# EasyEDA Pro project 新星杯51电子琴最终版.eprj

# Schematic Schematic1
Board Name: Board1; Create Date: 2025-08-16; Page Name: P1; Project Name: 新星杯51电子琴最终版; Schematic Name: Schematic1; Update Date: 2025-08-16; Company: 嘉立创EDA; Page Size: A4; Version: V1.0
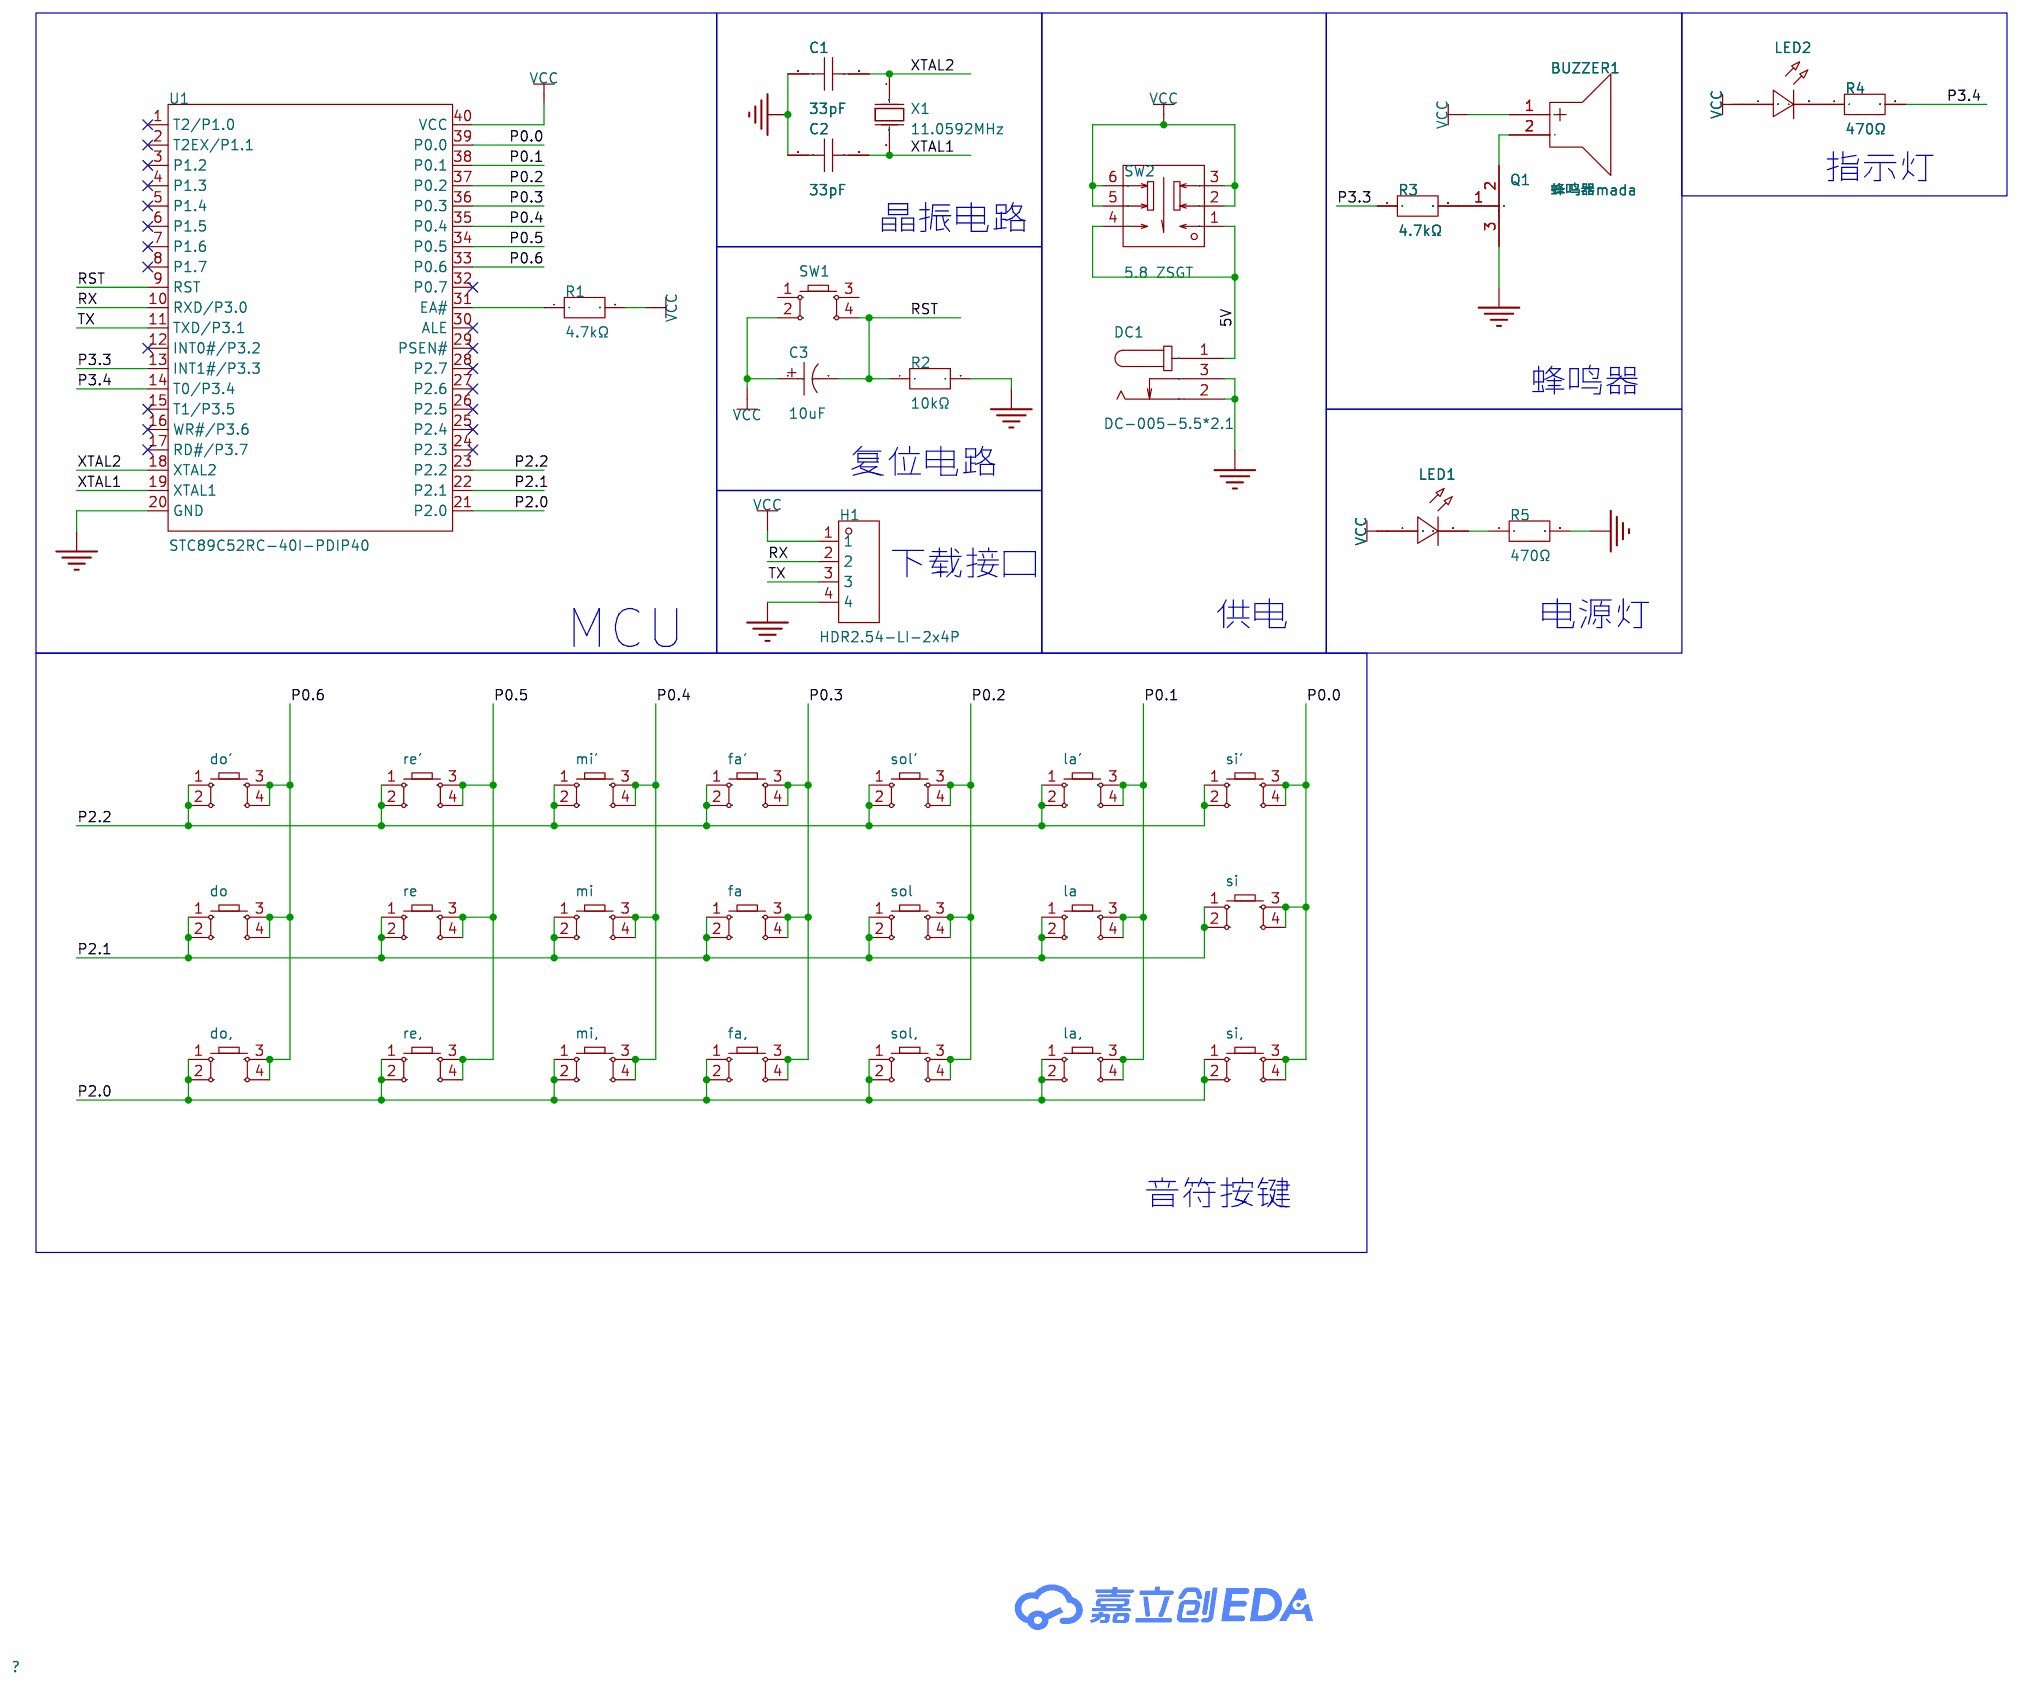
[diagram p0: schematic sheet]

## Parts
BUZZER1  蜂鸣器mada  [BUZ-TH_BD9.2-P5.00-D0.6-L-FD]
C1  33pF  [CAP-TH_L5.5-W5.0-P5.00-D0.6]
C2  33pF  [CAP-TH_L5.5-W5.0-P5.00-D0.6]
C3  10uF  [CAP-TH_BD5.0-P2.00-D0.5-FD]
DC1  DC-005-5.5*2.1  [DC-IN-TH_DC-005-2]
do  -  [SW-TH_4P-L6.0-W6.0-P4.50-LS6.5]
do'  -  [SW-TH_4P-L6.0-W6.0-P4.50-LS6.5]
do,  -  [SW-TH_4P-L6.0-W6.0-P4.50-LS6.5]
fa  -  [SW-TH_4P-L6.0-W6.0-P4.50-LS6.5]
fa'  -  [SW-TH_4P-L6.0-W6.0-P4.50-LS6.5]
fa,  -  [SW-TH_4P-L6.0-W6.0-P4.50-LS6.5]
H1  HDR2.54-LI-2x4P  [HDR-TH_4P-P2.54-V-M]
la  -  [SW-TH_4P-L6.0-W6.0-P4.50-LS6.5]
la'  -  [SW-TH_4P-L6.0-W6.0-P4.50-LS6.5]
la,  -  [SW-TH_4P-L6.0-W6.0-P4.50-LS6.5]
LED1  -  [LED_TH-3mm]
LED2  -  [LED-TH_5mm]
mi  -  [SW-TH_4P-L6.0-W6.0-P4.50-LS6.5]
mi'  -  [SW-TH_4P-L6.0-W6.0-P4.50-LS6.5]
mi,  -  [SW-TH_4P-L6.0-W6.0-P4.50-LS6.5]
Q1  -  [宽三极管]
R1  4.7kΩ  [RES-TH_BD2.2-L6.5-P10.50-D0.6]
R2  10kΩ  [RES-TH_BD2.2-L6.5-P10.50-D0.6]
R3  4.7kΩ  [RES-TH_BD2.2-L6.5-P10.50-D0.6]
R4  470Ω  [RES-TH_BD2.2-L6.5-P10.50-D0.6]
R5  470Ω  [RES-TH_BD2.2-L6.5-P10.50-D0.6]
re  -  [SW-TH_4P-L6.0-W6.0-P4.50-LS6.5]
re'  -  [SW-TH_4P-L6.0-W6.0-P4.50-LS6.5]
re,  -  [SW-TH_4P-L6.0-W6.0-P4.50-LS6.5]
si  -  [SW-TH_4P-L6.0-W6.0-P4.50-LS6.5]
si'  -  [SW-TH_4P-L6.0-W6.0-P4.50-LS6.5]
si,  -  [SW-TH_4P-L6.0-W6.0-P4.50-LS6.5]
sol  -  [SW-TH_4P-L6.0-W6.0-P4.50-LS6.5]
sol'  -  [SW-TH_4P-L6.0-W6.0-P4.50-LS6.5]
sol,  -  [SW-TH_4P-L6.0-W6.0-P4.50-LS6.5]
SW1  -  [SW-TH_4P-L6.0-W6.0-P4.50-LS6.5]
SW2  5.8 ZSGT  [SW-TH_5.8ZSGT]
U1  STC89C52RC-40I-PDIP40  [DIP-40_L52.0-W13.7-P2.54-LS15.2-BL]
X1  11.0592MHz  [HC-49US_L11.5-W4.5-P4.88]

## Library data of the parts
BUZZER1 = 蜂鸣器mada: Supplier Part: C9900017272; Supplier Footprint: BUZ-TH; JLCPCB Part Class: 扩展库; Supplier: LCSC
C1 C2 = CC45SL3DD330JYGNA: 容值:33pF;精度:±5%;额定电压:2kV;温度系数:SL;; LCSC Part Name: 33pF ±5% 2kV; Supplier Part: C5567764; Manufacturer: TDK; Supplier Footprint: 插件; JLCPCB Part Class: 扩展库; Datasheet: https://atta.szlcsc.com/upload/public/pdf/source/20221215/8A5EDD14E2FEF475EBFA37253E4ED503.pdf; Supplier: LCSC; Tolerance: ±5%; Voltage Rating: 2kV; Pin Spacing: 5mm; Temperature Coefficient: SL; Diameter: 5.5mm
C3 = KM106M025D11RR0VH2FP0: 容值:10uF;精度:±20%;额定电压:25V;纹波电流:38mA@120Hz;等效串联电阻(ESR):-;; LCSC Part Name: 10uF ±20% 25V; Supplier Part: C43347; Manufacturer: CX(承兴); Supplier Footprint: 插件,D5xL11mm; JLCPCB Part Class: 扩展库; Datasheet: https://atta.szlcsc.com/upload/public/pdf/source/20211027/06D6BA3719C264B639DC286D935D03EA.pdf; Supplier: LCSC; Tolerance: ±20%; Voltage Rating: 25V; Ripple Current: 38mA@120Hz; Pin Spacing: 2mm; Diameter: 5mm; Height - Seated (Max): 11mm; Lifetime: 1000hrs@105℃
DC1 = DC-005-5.5*2.1: Supplier Part: C9900017044; Supplier Footprint: DC-005; JLCPCB Part Class: 扩展库; Supplier: LCSC
do do' do, fa fa' fa, la la' la, mi mi' mi, re re' re, si si' si, sol sol' sol, SW1 = Key_TH_6x6x6: 触点电流:50mA;额定电压(DC):12V;绝缘电阻:100MΩ;电路结构:单刀单掷;安装方式:直插;按钮形状:圆形按钮;按钮/盖帽颜色:黑色;作用力:260gf@±30gf;工作温度:-25℃~+70℃;引脚样式:PC引脚;开关长度:6mm;开关宽度:6mm;开关高度:6mm;带支架:否;; Supplier Part: C2837516; Supplier Footprint: 插件
H1 = HDR2.54-LI-2x4P: Supplier Part: C9900020145; JLCPCB Part Class: 扩展库; Supplier: LCSC
LED1 = LED_TH-R_3mm: Supplier Footprint: 插件
LED2 = LED_TH-R_5mm: Supplier Footprint: 插件
Q1 = 宽三极管
R1-R3 = MF0W4FF4701A50: 电阻类型:金属膜电阻;阻值:4.7kΩ;精度:±1%;功率:250mW;温度系数:±50ppm/℃;; Supplier Part: C20625253; Manufacturer: UNI-ROYAL(厚声); Supplier Footprint: DIP; JLCPCB Part Class: 扩展库; Datasheet: https://atta.szlcsc.com/upload/public/pdf/source/20240311/FBFC508D1107E2DDB63DCA17D99F8DB3.pdf; Supplier: LCSC; Type: 金属膜电阻; Tolerance: ±1%; Power(Watts): 250mW; Temperature Coefficient: ±50ppm/℃
R4 R5 = MF0W4FF4700A50: 电阻类型:金属膜电阻;阻值:470Ω;精度:±1%;功率:250mW;温度系数:±50ppm/℃;; Supplier Part: C20625244; Manufacturer: UNI-ROYAL(厚声); Supplier Footprint: DIP; JLCPCB Part Class: 扩展库; Datasheet: https://atta.szlcsc.com/upload/public/pdf/source/20240311/FBFC508D1107E2DDB63DCA17D99F8DB3.pdf; Supplier: LCSC; Type: 金属膜电阻; Tolerance: ±1%; Power(Watts): 250mW; Temperature Coefficient: ±50ppm/℃
SW2 = 5.8 ZSGT: 电路结构:双刀双掷;自锁/无锁:自锁;安装方式:直插;触点电流:110mA;额定电压 (DC):30V;带灯:不带;作用力:1.5N;机械寿命:10万次;; LCSC Part Name: 5.8*5.8有头/高头 带锁/自锁开关 泡泡机开关; Supplier Part: C2681587; Manufacturer: SHOU HAN(首韩); Supplier Footprint: 插件; JLCPCB Part Class: 扩展库; Datasheet: https://atta.szlcsc.com/upload/public/pdf/source/20210107/C2681587_CDDDDA4A1C7AC9FEB01815B75893A6BA.pdf; Supplier: LCSC; Circuit: 双刀双掷; Self Lock / No Lock: 自锁; Actuator Style: 方形按钮; Mounting Style: 直插; Contact Current: 110mA; Voltage Rating (DC): 30V; Insulation Resistance: 100MΩ; Actuator/Cap Color: 白色; With Lamp: 不带; Pin Style: PC引脚; Operating Force: 1.5N; Operating Temperature: -10℃~+70℃; Mechanical Life: 10万次
U1 = STC89C52RC-40I-PDIP40: CPU内核:51系列;应用领域:-;; Supplier Part: C14022; Manufacturer: STC; Supplier Footprint: DIP-40; JLCPCB Part Class: 扩展库; Datasheet: https://atta.szlcsc.com/upload/public/pdf/source/20250219/C2F0DDDE7C5E9ADA5B33742D18630F09.pdf; Supplier: LCSC; CPU Core: 51系列; Program Storage Size: 8KB; Program Memory Type: FLASH; Number of I/O: 35; Voltage - Supply: 3.3V~5.5V
X1 = X49SD110592MSD2SC: 晶振类型:直插晶振;频率:11.0592MHz;常温频差:±20ppm;负载电容:20pF;频率稳定度:±30ppm;; LCSC Part Name: HC-49US 11.0592MHZ 2P 49S 20PF ±20PPM -20~70℃（±30PPM）; Supplier Part: C2203; Manufacturer: YXC(扬兴晶振); Supplier Footprint: HC-49S; JLCPCB Part Class: 扩展库; Datasheet: https://atta.szlcsc.com/upload/public/pdf/source/20240329/977D7F2434F98B2BE33270BB9FF3D86D.pdf; Supplier: LCSC; Type: 直插晶振; Normal temperature Frequency Tolerance: ±20ppm; Load Capacitance: 20pF; Frequency Stability: ±30ppm; Operating Temperature: -20℃~+70℃

## Nets
5V: DC1.1 SW2.1 SW2.4
GND: C1.1 C2.1 DC1.2 DC1.3 H1.4 Q1.3 R2.2 R5.2 U1.20(GND)
VCC: BUZZER1.1(+) C3.1 H1.1 LED1.1(C) LED2.1(C) R1.2 SW1.2 SW2.2 SW2.3 SW2.5 SW2.6 U1.40(VCC)
P0.0: si.3 si.4 si'.3 si'.4 si,.3 si,.4 U1.39(P0.0)
P0.1: la.3 la.4 la'.3 la'.4 la,.3 la,.4 U1.38(P0.1)
P0.2: sol.3 sol.4 sol'.3 sol'.4 sol,.3 sol,.4 U1.37(P0.2)
P0.3: fa.3 fa.4 fa'.3 fa'.4 fa,.3 fa,.4 U1.36(P0.3)
P0.4: mi.3 mi.4 mi'.3 mi'.4 mi,.3 mi,.4 U1.35(P0.4)
P0.5: re.3 re.4 re'.3 re'.4 re,.3 re,.4 U1.34(P0.5)
P0.6: do.3 do.4 do'.3 do'.4 do,.3 do,.4 U1.33(P0.6)
P2.0: do,.1 do,.2 fa,.1 fa,.2 la,.1 la,.2 mi,.1 mi,.2 re,.1 re,.2 si,.1 si,.2 sol,.1 sol,.2 U1.21(P2.0)
P2.1: do.1 do.2 fa.1 fa.2 la.1 la.2 mi.1 mi.2 re.1 re.2 si.1 si.2 sol.1 sol.2 U1.22(P2.1)
P2.2: do'.1 do'.2 fa'.1 fa'.2 la'.1 la'.2 mi'.1 mi'.2 re'.1 re'.2 si'.1 si'.2 sol'.1 sol'.2 U1.23(P2.2)
P3.3: R3.1 U1.13(INT1#/P3.3)
P3.4: R4.2 U1.14(T0/P3.4)
RST: C3.2 R2.1 SW1.4 U1.9(RST)
RX: H1.2 U1.10(RXD/P3.0)
TX: H1.3 U1.11(TXD/P3.1)
XTAL1: C2.2 U1.19(XTAL1) X1.2(OSC2)
XTAL2: C1.2 U1.18(XTAL2) X1.1(OSC1)
Net-(BUZZER1-2): BUZZER1.2(-) Q1.2
Net-(LED1-2): LED1.2(A) R5.1
Net-(LED2-2): LED2.2(A) R4.1
Net-(Q1-1): Q1.1 R3.2
Net-(R1-1): R1.1 U1.31(EA#)

Not connected (* = marked no-connect by the designer): SW1 1 3; U1 1(T2/P1.0)* 2(T2EX/P1.1)* 3(P1.2)* 4(P1.3)* 5(P1.4)* 6(P1.5)* 7(P1.6)* 8(P1.7)* 12(INT0#/P3.2)* 15(T1/P3.5)* 16(WR#/P3.6)* 17(RD#/P3.7)* 24(P2.3)* 25(P2.4)* 26(P2.5)* 27(P2.6)* 28(P2.7)* 29(PSEN#)* 30(ALE)* 32(P0.7)*

## Notes on the sheet
- 指示灯
- 晶振电路
- 蜂鸣器
- 复位电路
- 下载接口
- 供电
- 电源灯
- MCU
- 音符按键

# Board PCB1
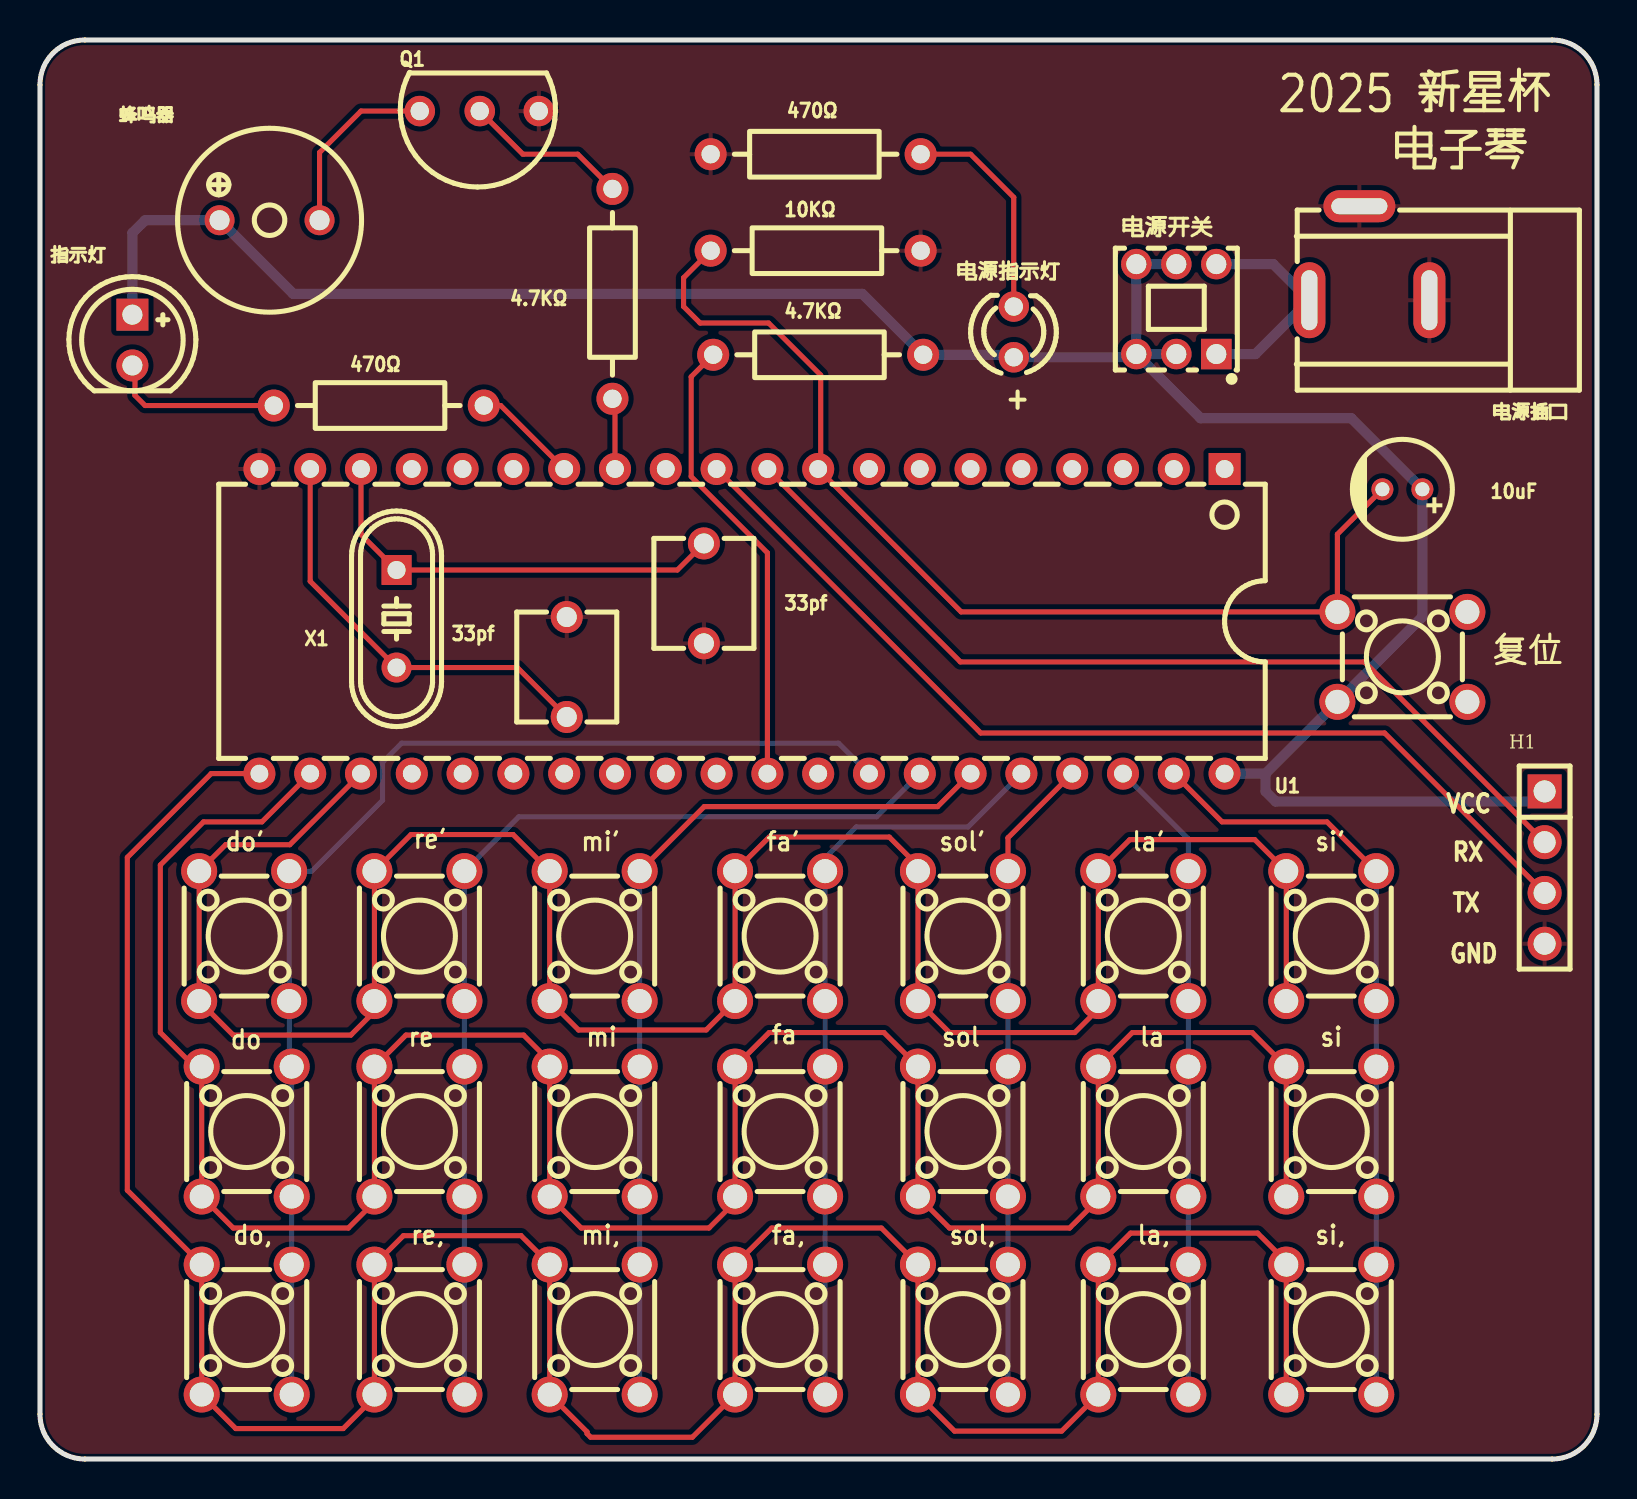
[diagram p1: board, top side]
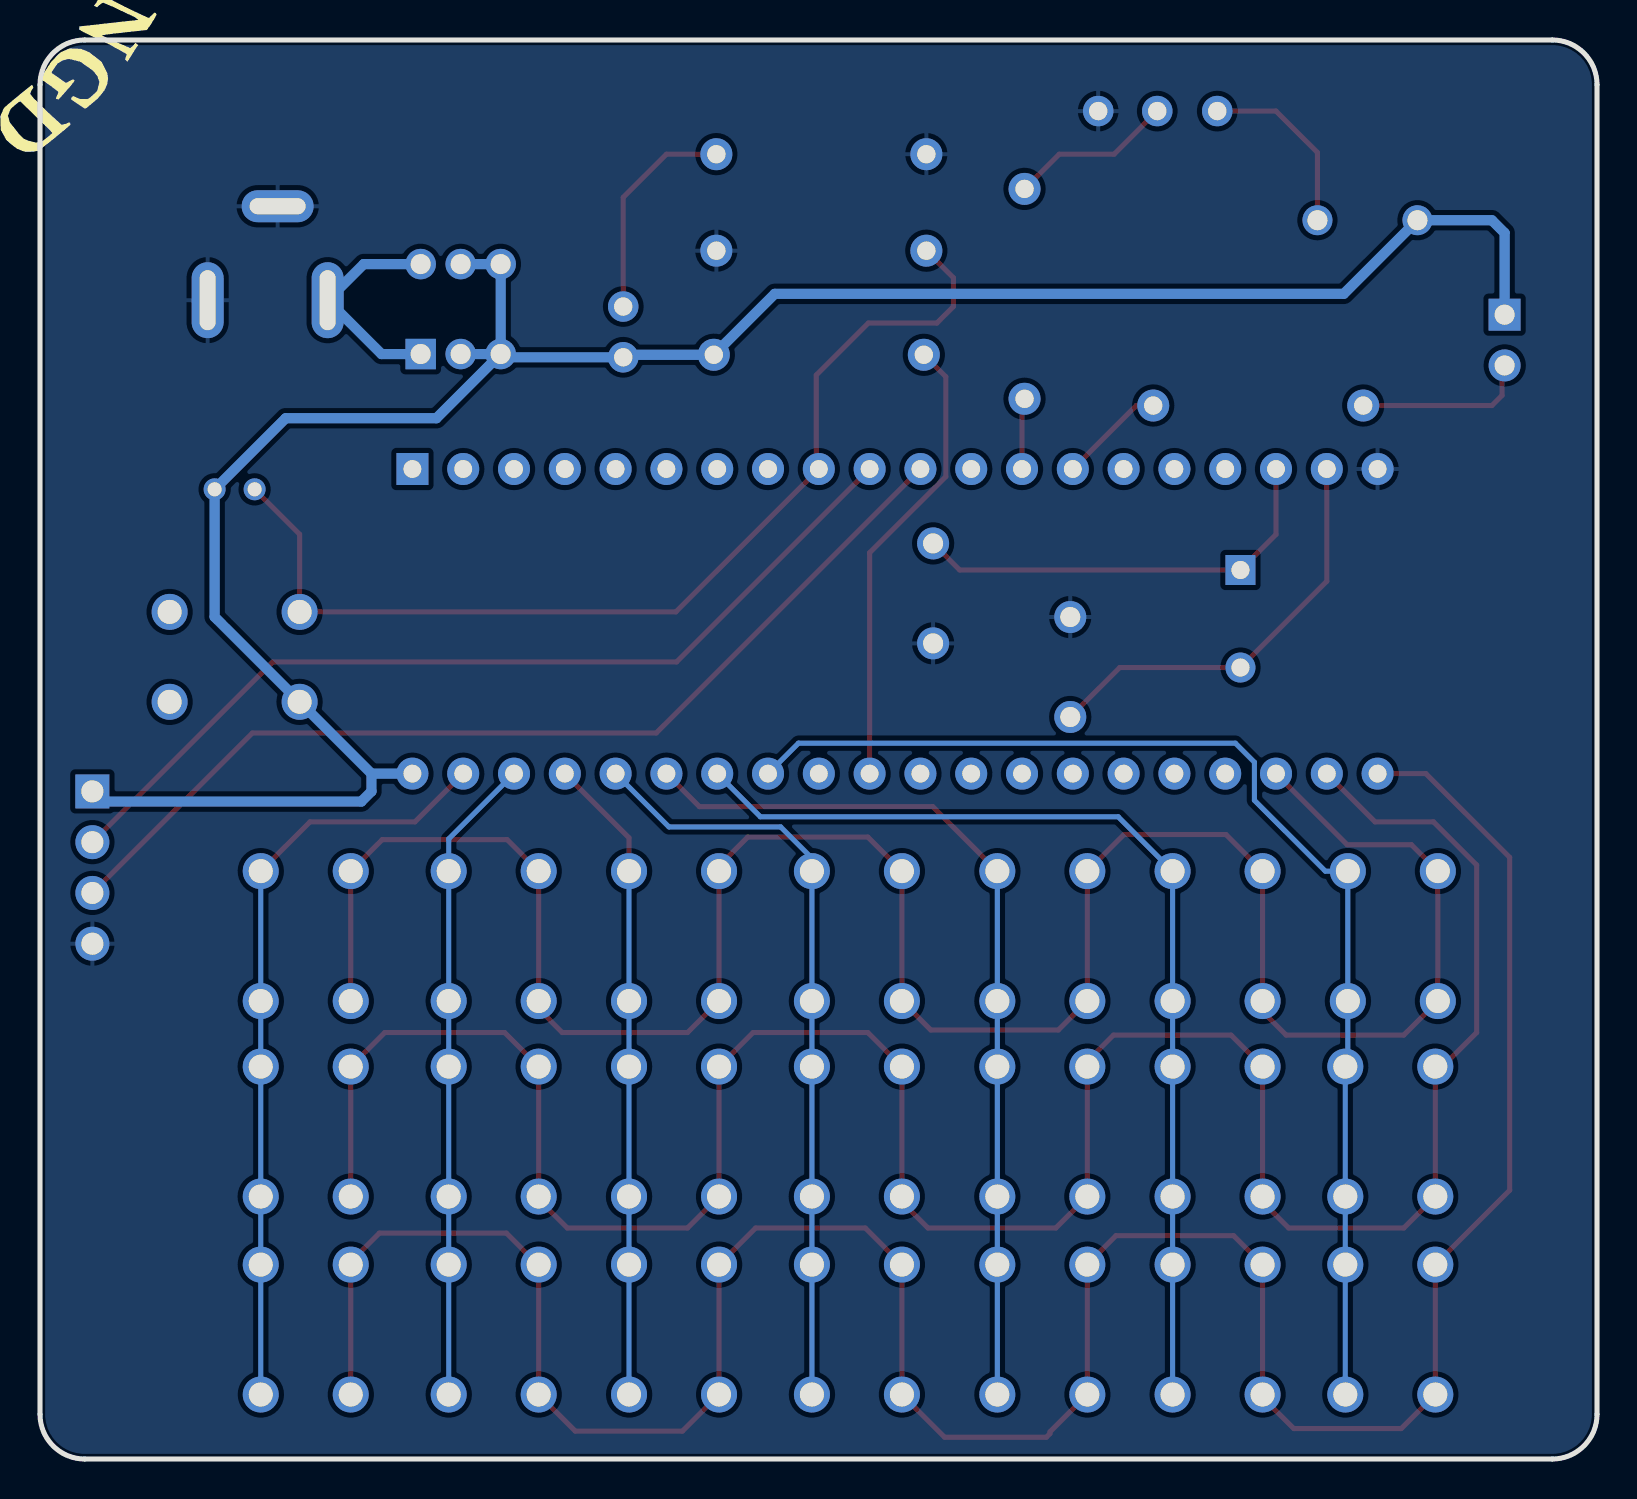
[diagram p2: board, bottom side, seen from below]

Outline 77.85 x 70.99 mm; copper layers: Top Layer, Bottom Layer. Coordinates in mm from the lower left corner of the outline.
Outline path: 0,68.76 0,2.23 arc(0.66,0.65) 2.24,0 75.62,0 arc(77.2,0.65) 77.85,2.23 77.85,68.76 arc(77.2,70.34) 75.62,70.99 2.24,70.99 arc(0.65,70.34) 0,68.76
Stack: Top Layer 0.035mm / Dielectric1 1.51mm FR4 er 4.5 / Bottom Layer 0.035mm

## Design rules (mm)
template: JLCPCB Capability(Two Layers Board)
spacing copperThickness1oz (default): track to track 0.102, other pairs 0.152 to 0.3
spacing copperThickness2oz: track to track 0.203, other pairs 0.152 to 0.3
track width copperThickness1oz (default): min 0.127, default 0.254, max 2.54
track width copperThickness2oz: min 0.203, default 0.254, max 2.54
differential pair differentialPair (default): width min 0.127, default 0.254, max 2.54; gap min 0.152, default 0.152
via viaSize (default): diameter min 0.5, default 0.61, max 10; hole min 0.3, default 0.305, max 6.3

## Placement (name value [footprint] x y rotation side)
4.7KΩ  -  [RES-TH_BD2.2-L6.5-P10.50-D0.6]  38.91 55.24 0 top
4.7KΩ#2  -  [RES-TH_BD2.2-L6.5-P10.50-D0.6]  28.62 58.29 90 top
10KΩ  10kΩ  [RES-TH_BD2.2-L6.5-P10.50-D0.6]  38.78 60.45 0 top
10uF  10uF  [CAP-TH_BD5.0-P2.00-D0.5-FD]  68.12 48.51 180 top
33pf  -  [CAP-TH_L5.5-W5.0-P5.00-D0.6]  33.2 43.31 90 top
33pf#2  -  [CAP-TH_L5.5-W5.0-P5.00-D0.6]  26.34 39.62 270 top
470Ω  -  [RES-TH_BD2.2-L6.5-P10.50-D0.6]  16.94 52.7 0 top
470Ω#2  -  [RES-TH_BD2.2-L6.5-P10.50-D0.6]  38.78 65.28 180 top
do  -  [SW-TH_4P-L6.0-W6.0-P4.50-LS6.5]  10.34 16.38 90 top
do'  -  [SW-TH_4P-L6.0-W6.0-P4.50-LS6.5]  10.21 26.16 90 top
do,  -  [SW-TH_4P-L6.0-W6.0-P4.50-LS6.5]  10.34 6.48 90 top
fa  -  [SW-TH_4P-L6.0-W6.0-P4.50-LS6.5]  37.01 16.38 90 top
fa'  -  [SW-TH_4P-L6.0-W6.0-P4.50-LS6.5]  37.01 26.16 90 top
fa,  -  [SW-TH_4P-L6.0-W6.0-P4.50-LS6.5]  37.01 6.48 90 top
H1  HDR2.54-LI-2x4P  [HDR-TH_4P-P2.54-V-M]  75.23 29.59 270 top
la  -  [SW-TH_4P-L6.0-W6.0-P4.50-LS6.5]  55.17 16.38 90 top
la'  -  [SW-TH_4P-L6.0-W6.0-P4.50-LS6.5]  55.17 26.16 90 top
la,  -  [SW-TH_4P-L6.0-W6.0-P4.50-LS6.5]  55.17 6.48 90 top
mi  -  [SW-TH_4P-L6.0-W6.0-P4.50-LS6.5]  27.73 16.38 90 top
mi'  -  [SW-TH_4P-L6.0-W6.0-P4.50-LS6.5]  27.73 26.16 90 top
mi,  -  [SW-TH_4P-L6.0-W6.0-P4.50-LS6.5]  27.73 6.48 90 top
Q1  -  [宽三极管]  22.02 67.18 0 top
re  -  [SW-TH_4P-L6.0-W6.0-P4.50-LS6.5]  18.97 16.38 90 top
re'  -  [SW-TH_4P-L6.0-W6.0-P4.50-LS6.5]  18.97 26.16 90 top
re,  -  [SW-TH_4P-L6.0-W6.0-P4.50-LS6.5]  18.97 6.48 90 top
si  -  [SW-TH_4P-L6.0-W6.0-P4.50-LS6.5]  64.56 16.38 90 top
si'  -  [SW-TH_4P-L6.0-W6.0-P4.50-LS6.5]  64.56 26.16 90 top
si,  -  [SW-TH_4P-L6.0-W6.0-P4.50-LS6.5]  64.56 6.48 90 top
sol  -  [SW-TH_4P-L6.0-W6.0-P4.50-LS6.5]  46.15 16.38 90 top
sol'  -  [SW-TH_4P-L6.0-W6.0-P4.50-LS6.5]  46.15 26.16 90 top
sol,  -  [SW-TH_4P-L6.0-W6.0-P4.50-LS6.5]  46.15 6.48 90 top
U1  STC89C52RC-40I-PDIP40  [DIP-40_L52.0-W13.7-P2.54-LS15.2-BL]  35.1 41.91 180 top
X1  11.0592MHz  [HC-49US_L11.5-W4.5-P4.88]  17.83 42.04 270 top
复位  -  [SW-TH_4P-L6.0-W6.0-P4.50-LS6.5]  68.12 40.13 180 top
指示灯  -  [LED-TH_5mm]  4.62 55.98 270 top
电源开关  5.8 ZSGT  [SW-TH_5.8ZSGT]  56.82 57.53 0 top
电源指示灯  -  [LED_TH-3mm]  48.69 56.39 90 top
电源插口  DC-005-5.5*2.1  [DC-IN-TH_DC-005-2]  66.47 60.32 180 top
蜂鸣器  蜂鸣器mada  [BUZ-TH_BD9.2-P5.00-D0.6-L-FD]  11.48 61.98 0 top

## Footprints (pads in the part's own frame, mm; a bottom-side part is the same pattern mirrored in y, then rotated)
BUZ-TH_BD9.2-P5.00-D0.6-L-FD
  round 1.5 hole 1: 1(-2.5,0) 2(2.5,0)
CAP-TH_BD5.0-P2.00-D0.5-FD
  round 1.1 hole 0.7: 1(-1,0) 2(1,0)
CAP-TH_L5.5-W5.0-P5.00-D0.6
  round 1.6 hole 1: 1(-2.5,0) 2(2.5,0)
DC-IN-TH_DC-005-2
  oval 1.6x3.8 hole 0.8x3: 1(2.999,2.35) 2(-3,2.35)
  oval 3.6x1.6 hole 2.8x0.8: 3(0.5,-2.35)
DIP-40_L52.0-W13.7-P2.54-LS15.2-BL
  rect 1.6x1.6 hole 0.889: 1(-24.13,-7.62)
  round 1.6 hole 0.889: 2(-21.59,-7.62) 3(-19.05,-7.62) 4(-16.51,-7.62) 5(-13.97,-7.62) 6(-11.43,-7.62) 7(-8.89,-7.62) 8(-6.35,-7.62) 9(-3.81,-7.62) 10(-1.27,-7.62) 11(1.27,-7.62) 12(3.81,-7.62) 13(6.35,-7.62) 14(8.89,-7.62) 15(11.43,-7.62) 16(13.97,-7.62) 17(16.51,-7.62) 18(19.05,-7.62) 19(21.59,-7.62) 20(24.13,-7.62) 21(24.13,7.62) 22(21.59,7.62) 23(19.05,7.62) 24(16.51,7.62) 25(13.97,7.62) 26(11.43,7.62) 27(8.89,7.62) 28(6.35,7.62) 29(3.81,7.62) 30(1.27,7.62) 31(-1.27,7.62) 32(-3.81,7.62) 33(-6.35,7.62) 34(-8.89,7.62) 35(-11.43,7.62) 36(-13.97,7.62) 37(-16.51,7.62) 38(-19.05,7.62) 39(-21.59,7.62) 40(-24.13,7.62)
HC-49US_L11.5-W4.5-P4.88
  rect 1.5x1.5 hole 0.9: 1(-2.44,0)
  round 1.5 hole 0.9: 2(2.44,0)
HDR-TH_4P-P2.54-V-M
  rect 1.7x1.7 hole 1.1: 1(-3.81,0)
  round 1.7 hole 1.1: 2(-1.27,0) 3(1.27,0) 4(3.81,0)
LED-TH_5mm
  rect 1.6x1.6 hole 1: 1(-1.27,0)
  round 1.6 hole 1: 2(1.27,0)
LED_TH-3mm
  round 1.524 hole 0.914: 1(-1.27,0) 2(1.27,0)
RES-TH_BD2.2-L6.5-P10.50-D0.6
  round 1.6 hole 0.914: 1(-5.25,0) 2(5.25,0)
SW-TH_4P-L6.0-W6.0-P4.50-LS6.5
  round 1.8 hole 1.2: 1(-3.25,2.25) 2(3.25,2.25) 3(-3.25,-2.25) 4(3.25,-2.25)
SW-TH_5.8ZSGT
  rect 1.524x1.524 hole 1: 1(2,-2.25)
  round 1.524 hole 1: 2(0,-2.25) 3(-2,-2.25) 4(2,2.25) 5(0,2.25) 6(-2,2.25)
宽三极管
  round 1.524 hole 0.914: 1(-0.032,0.254) 2(-3.031,0.254) 3(2.921,0.254)

## Nets
GND: 10KΩ.2 33pf.1 33pf#2.1 470Ω#2.2 H1.4 Q1.3 U1.20 电源插口.2 电源插口.3
VCC: 4.7KΩ.2 10uF.1 H1.1 U1.40 复位.2 指示灯.1 电源开关.2 电源开关.3 电源开关.5 电源开关.6 电源指示灯.1 蜂鸣器.1
P0.0: si.3 si.4 si'.3 si'.4 si,.3 si,.4 U1.39
P0.1: la.3 la.4 la'.3 la'.4 la,.3 la,.4 U1.38
P0.2: sol.3 sol.4 sol'.3 sol'.4 sol,.3 sol,.4 U1.37
P0.3: fa.3 fa.4 fa'.3 fa'.4 fa,.3 fa,.4 U1.36
P0.4: mi.3 mi.4 mi'.3 mi'.4 mi,.3 mi,.4 U1.35
P0.5: re.3 re.4 re'.3 re'.4 re,.3 re,.4 U1.34
P0.6: do.3 do.4 do'.3 do'.4 do,.3 do,.4 U1.33
P2.0: do,.1 do,.2 fa,.1 fa,.2 la,.1 la,.2 mi,.1 mi,.2 re,.1 re,.2 si,.1 si,.2 sol,.1 sol,.2 U1.21
P2.1: do.1 do.2 fa.1 fa.2 la.1 la.2 mi.1 mi.2 re.1 re.2 si.1 si.2 sol.1 sol.2 U1.22
P2.2: do'.1 do'.2 fa'.1 fa'.2 la'.1 la'.2 mi'.1 mi'.2 re'.1 re'.2 si'.1 si'.2 sol'.1 sol'.2 U1.23
P3.3: 4.7KΩ#2.1 U1.13
P3.4: 470Ω.2 U1.14
RST: 10KΩ.1 10uF.2 U1.9 复位.4
RX: H1.2 U1.10
TX: H1.3 U1.11
XTAL1: 33pf#2.2 U1.19 X1.2
XTAL2: 33pf.2 U1.18 X1.1
$1N1522: 4.7KΩ.1 U1.31
$1N2949: Q1.2 蜂鸣器.2
$1N5500: 470Ω#2.1 电源指示灯.2
$1N5508: 470Ω.1 指示灯.2
$1N7660: 电源开关.1 电源开关.4 电源插口.1
$1N8757: 4.7KΩ#2.2 Q1.1

Pads without a net: U1 1 2 3 4 5 6 7 8 12 15 16 17 24 25 26 27 28 29 30 32; 复位 1 3

## Routing (per net, layer and track width the routed paths; a pad name or vN(x,y) marks a point on that pad's centre or on a via; arc(x,y) is an arc through that point)
VCC: length 117.8
  Bottom Layer w0.508: 61.28,34.29 61.28,33.4 61.79,32.89 74.72,32.89 H1.1 ; 61.28,34.29 U1.40 ; 61.28,34.29 复位.2 69.12,42.13 10uF.1 65.56,52.07 58.03,52.07 电源开关.3 ; 电源开关.5 电源开关.6 电源开关.3 ; 电源开关.3 54.65,55.12 电源指示灯.1 48.56,55.24 4.7KΩ.2 41.11,58.29 12.66,58.29 蜂鸣器.1 5.26,61.98 4.62,61.34 4.62,57.25 ; 电源开关.3 电源开关.2
P0.0: length 38.3
  Top Layer w0.254: si'.4 64.35,31.88 59.1,31.88 U1.39
  Bottom Layer w0.254: si'.4 si'.3 si.4 si.3 si,.4 si,.3
P0.1: length 32.4
  Bottom Layer w0.254: la,.3 la,.4 la.3 la.4 la'.3 la'.4 57.42,31.02 U1.38
P0.2: length 32.4
  Top Layer w0.254: sol'.4 48.4,31.08 U1.37
  Bottom Layer w0.254: sol'.4 sol'.3 sol.4 sol.3 sol,.4 sol,.3
P0.3: length 38.4
  Bottom Layer w0.254: fa,.3 fa,.4 fa.3 fa.4 fa'.3 fa'.4 39.26,30.06 40.82,31.62 46.4,31.62 U1.36
P0.4: length 44.8
  Top Layer w0.254: U1.35 44.88,32.64 33.21,32.64 mi'.4
  Bottom Layer w0.254: mi'.4 mi'.3 mi.4 mi.3 mi,.4 mi,.3
P0.5: length 51
  Bottom Layer w0.254: U1.34 41.83,32.13 23.94,32.13 re'.4 re'.3 re.4 re.3 re,.4 re,.3
P0.6: length 59.6
  Bottom Layer w0.254: U1.33 39.93,35.81 18.08,35.81 17.13,34.86 17.13,32.96 13.59,29.41 do'.4 do'.3 12.46,19.76 do.4 do.3 do,.4 do,.3
P2.0: length 138.9
  Top Layer w0.254: U1.21 8.56,34.29 4.37,30.1 4.37,13.45 do,.2 do,.1 9.79,1.52 15.16,1.52 16.72,3.08 re,.1 re,.2 18.17,11.18 24.05,11.18 25.48,9.74 mi,.2 mi,.1 27.35,1.36 27.35,1.27 27.53,1.09 32.62,1.09 fa,.1 fa,.2 36.59,11.56 42.07,11.56 sol,.2 sol,.1 45.73,1.4 51.09,1.4 la,.1 la,.2 52.96,9.73 54.53,11.3 60.88,11.3 62.31,9.87 si,.2 si,.1
P2.1: length 128.9
  Top Layer w0.254: U1.22 11.1,31.88 8.18,31.88 6.02,29.72 6.02,21.34 7.72,19.63 do.2 do.1 9.66,11.56 15.42,11.56 16.72,12.86 re.1 re.2 18.3,21.21 24.18,21.21 25.48,19.9 mi.2 mi.1 27.06,11.56 33.45,11.56 34.76,12.86 fa.1 fa.2 36.46,21.34 42.2,21.34 sol.2 sol.1 45.48,11.56 51.48,11.56 52.92,12.99 la.1 la.2 54.62,21.34 60.61,21.34 si.2 si.1
P2.2: length 118.8
  Top Layer w0.254: si'.1 si'.2 60.74,30.99 54.49,30.99 la'.2 la'.1 52.92,22.51 51.74,21.34 45.48,21.34 sol'.1 sol'.2 43.9,29.68 42.47,31.11 36.46,31.11 fa'.2 fa'.1 33.31,21.46 26.93,21.46 mi'.1 mi'.2 23.65,31.24 18.55,31.24 re'.2 re'.1 16.72,22.39 15.54,21.21 9.66,21.21 do'.1 do'.2 9.28,30.73 12.49,30.73 U1.23
P3.3: length 3.6
  Top Layer w0.254: U1.13 28.75,52.92 4.7KΩ#2.1
P3.4: length 5.3
  Top Layer w0.254: U1.14 23.04,52.7 470Ω.2
RST: length 52.4
  Top Layer w0.254: 10uF.2 64.87,46.26 复位.4 46.06,42.38 U1.9 39.04,49.66 39.04,54.23 36.43,56.83 33,56.83 32.18,57.66 32.18,59.1 10KΩ.1
RX: length 46.6
  Top Layer w0.254: H1.2 66.22,39.88 46.02,39.88 U1.10
TX: length 50.2
  Top Layer w0.254: U1.11 47.04,36.32 67.23,36.32 H1.3
XTAL1: length 21.3
  Top Layer w0.254: 33pf#2.2 23.86,39.6 X1.2 13.51,43.91 U1.19
XTAL2: length 21.7
  Top Layer w0.254: 33pf.2 31.87,44.48 X1.1 16.05,46.25 U1.18
$1N1522: length 23
  Top Layer w0.254: 4.7KΩ.1 32.56,54.14 32.56,49.15 36.37,45.34 U1.31
$1N2949: length 9.3
  Top Layer w0.254: Q1.2 16.05,67.44 13.98,65.36 蜂鸣器.2
$1N5500: length 11
  Top Layer w0.254: 470Ω#2.1 46.53,65.28 48.69,63.12 电源指示灯.2
$1N5508: length 8.7
  Top Layer w0.254: 指示灯.2 4.75,54.58 4.75,53.21 5.26,52.7 470Ω.1
$1N7660: length 11.2
  Bottom Layer w0.508: 电源开关.4 61.66,59.78 电源插口.1 60.78,55.28 电源开关.1
$1N8757: length 8.2
  Top Layer w0.254: Q1.1 24.15,65.28 26.89,65.28 4.7KΩ#2.2

## Copper pours and planes (outline as drawn; the poured copper is in the pictures)
GND on Top Layer: 0.05,68.76 0.06,69.02 0.12,69.31 0.21,69.6 0.34,69.86 0.51,70.11 0.7,70.34 0.93,70.53 1.18,70.7 1.45,70.83 1.73,70.92 2.02,70.98 2.28,70.99 75.66,70.99 75.93,70.98 76.22,70.92 76.5,70.83 76.77,70.7 77.02,70.53 77.24,70.34 77.44,70.11 77.61,69.86 77.74,69.6 77.83,69.31 77.88,69.02 77.9,68.76 77.9,2.23 77.88,1.97 77.83,1.68 77.74,1.4 77.61,1.13 77.44,0.88 77.24,0.65 77.02,0.46 76.77,0.29 76.5,0.16 76.22,0.07 75.93,0.01 75.66,0 2.28,0 2.02,0.01 1.73,0.07 1.45,0.16 1.18,0.29 0.93,0.46 0.7,0.65 0.51,0.88 0.34,1.13 0.21,1.4 0.12,1.68 0.06,1.97 0.05,2.23
GND on Bottom Layer: 0.05,68.88 0.06,69.15 0.12,69.44 0.21,69.72 0.34,69.99 0.51,70.24 0.7,70.46 0.93,70.66 1.18,70.83 1.45,70.96 1.73,71.05 2.02,71.1 2.28,71.12 75.54,71.12 75.8,71.1 76.09,71.05 76.38,70.96 76.64,70.83 76.89,70.66 77.12,70.46 77.31,70.24 77.48,69.99 77.61,69.72 77.7,69.44 77.76,69.15 77.77,68.88 77.77,2.23 77.76,1.97 77.7,1.68 77.61,1.4 77.48,1.13 77.31,0.88 77.12,0.65 76.89,0.46 76.64,0.29 76.38,0.16 76.09,0.07 75.8,0.01 75.54,0 2.28,0 2.02,0.01 1.73,0.07 1.45,0.16 1.18,0.29 0.93,0.46 0.7,0.65 0.51,0.88 0.34,1.13 0.21,1.4 0.12,1.68 0.06,1.97 0.05,2.23

## Text on the board
Top Silkscreen Layer: VCC | GND | RX | TX | + | 2025 新星杯 / 电子琴
